# Altium schematic sheet Alimentacao.SchDoc
size A4; SheetNumber: 3; SheetTotal: 7; SPICEModelCacheZJBQYOKP: <root> / <DocumentId>ZJBQYOKP</DocumentId> / <CacheFrame Number="0"> / <Model Name="spst_switch" Kind="CKT"> / <Text>*------------------------- / *SPST Sw Button / * state: if closed&gt;0 - closed else open / * Rclosed -  Closed state resistance / * Ropen -  Open state resistance (Ropen/Rclosed &lt; 1E10) / .SUBCKT  SPST_Switch node1  node2  PARAMS: / + closed=0 / + Rclosed=1m / + Ropen=1Meg / B1 int1 0 V={if(closed&gt;0,1,0)} / S1 node1 node2 int1 0 Smod / .model Smod Vswitch(Ron={Rclosed} Roff={Ropen}) / .ends</Text> / </Model> / </CacheFrame> / </root>
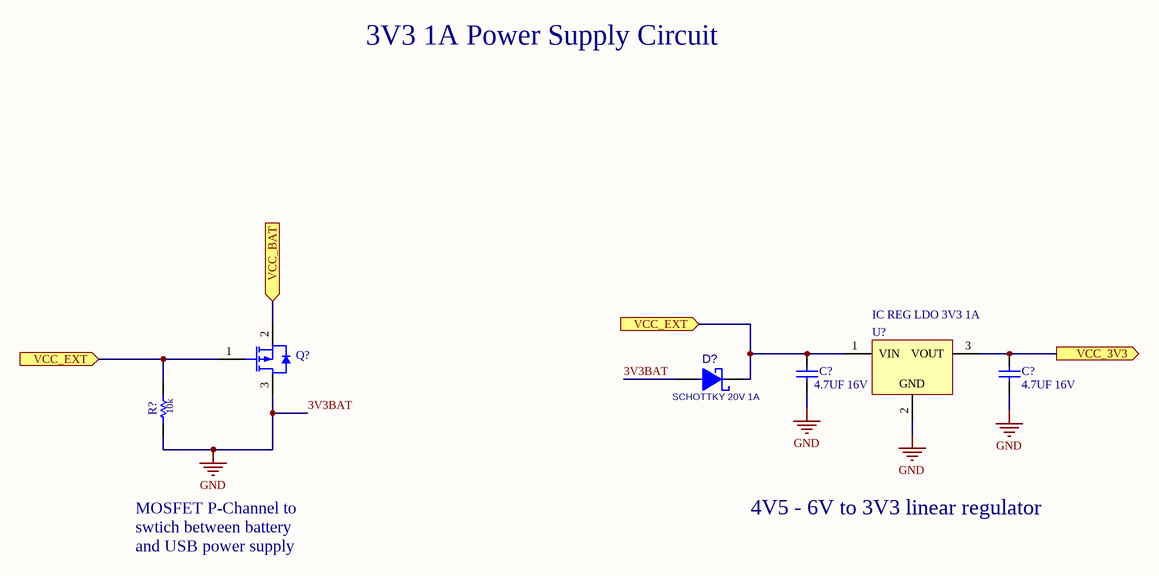
[diagram p0: Alimentacao.SchDoc]

## Parts
(Parts that share a designator on the sheet are numbered #1, #2 ... from top to bottom, then left to right.)
C?#1  4.7UF 16V  [CC2012-0805]
C?#2  4.7UF 16V  [CC2012-0805]
D?  SCHOTTKY 20V 1A  [SOD-323]
Q?  IC MOSFET P_CHANNEL 500mA  [SOT-23]  (value not drawn)
R?  RES 10K 1/10W 1% 0603 SMD  [CR1608-0603]  (value not drawn)
U?  IC REG LDO 3V3 1A  [SOT-223]

## Ports
VCC_3V3 (out), VCC_BAT (in), VCC_EXT (in)

## Nets
3V3BAT: C?#1.1 C?#2.1 D?.A Q?.3(DRAIN) R?.1 U?.2(GND)  [also labelled GND]
VCC_3V3: C?#2.2 U?.3(VOUT) ; port VCC_3V3
VCC_BAT: Q?.2(SOURCE) ; port VCC_BAT
VCC_EXT: C?#1.2 D?.K Q?.1(GATE) R?.2 U?.1(VIN) ; port VCC_EXT

## Notes on the sheet
- 3V3 1A Power Supply Circuit
- 4V5 - 6V to 3V3 linear regulator
- MOSFET P-Channel to swtich between battery and USB power supply

## Library data of the parts
C?#1 C?#2 = CMP-004-000075-2: CAP CER 4.7UF 16V X7R 0805; Manufacturer Part Number 1: 0805F475M160NT; Manufacturer 1: FH(Guangdong Fenghua Advanced Tech); Tolerance: 10%; Radiation Hardening: No; Thickness: 0.057inch; Package Quantity: 1; REACH SVHC: No SVHC; Case Code (Imperial): 0805; Termination: SMD/SMT; Case/Package: 0805; Supplier Unit Price 1: 0,0214; Case Code (Metric): 2012; Dielectric: X7R; Ratings: AEC-Q200; Voltage Rating: 16V; Depth: 1.25mm; Length: 2mm; Source: mits.SchLib; Design Item ID: CAP CER 4.7uF 16V 20% Y5V 0805 SMD; Resistor Type: Ceramic; RoHS Compliant: Yes; Packaging: Tape and Reel; Weight: 0.000194oz; Min Operating Temperature: -55°C; Height: 1.25mm; Capacitance: 4.7uF; Voltage Rating (DC): 16V; Width: 0.049inch; Max Operating Temperature: 125°C; Series: CGA; Mount: Surface Mount; Lead Free: Lead Free
D? = CMP-008-000014-1: DIODE SCHOTTKY 20V 1A SOD323; Manufacturer: ON Semiconductor; Manufacturer Part Number: NSR0320MW2T1G; Capacitance @ Vr, F: 29pF @ 5V, 1MHz; Speed: Fast Recovery =< 500ns, > 200mA (Io); Current - Reverse Leakage @ Vr: 50µA @ 15V; Current - Average Rectified (Io): 1A (DC); Voltage - Forward (Vf) (Max) @ If: 500mV @ 900mA; Pricing 1: 1=0.4, 10=0.298, 100=0.1689, 500=0.11188, 1000=0.08577 (USD); Design Item ID: DIODE SCHOTTKY NSR0320MW2T1G 20V 1A SOD323 SMD; Supplier Device Package: SOD-323; ComponentLink1URL: http://www.onsemi.com/pub_link/Collateral/NSR0320MW2T1-D.PDF; Packaging: Cut Tape (CT); Package / Case: SC-76, SOD-323; ComponentLink1Description: http://www.onsemi.com/pub_link/Collateral/NSR0320MW2T1-D.PDF; Reverse Recovery Time (trr): -; Voltage - DC Reverse (Vr) (Max): 20V; RoHS: RoHS Compliant; Mounting Type: Surface Mount; Diode Type: Schottky; Category: Discrete Semiconductor Products; Operating Temperature - Junction: -55°C ~ 125°C; Part Status: Active; Stock 1: 617; Source: mits.SchLib
Q? = IC MOSFET P_CHANNEL 500mA: P-Channel 30 V 530 mA 1 Ohm Surface Mount Enhancement Mode Mosfet - SOT-23; Manufacturer: Diodes; Manufacturer Part Number: DMP31D0U-7; Rise Time: 5.85ns; Drain to Source Voltage (Vdss): 30V; Continuous Drain Current (ID): 530mA; Rds On Max: 1R; Input Capacitance: 76pF; Max Power Dissipation: 450mW; Turn-On Delay Time: 4.98ns; Turn-Off Delay Time: 35.71ns; Fall Time: 16.64ns; Drain to Source Resistance: 2R; Element Configuration: Single; Gate to Source Voltage (Vgs): 8V; RoHS: Yes; Category: MOSFETs; Stock 1: 11550; Pricing 1: 50=0,43400, 500=0,36900, 1250=0,32500, 5000=0,28200 (USD); Mount: Surface Mount; Case/Package: SOT-23; Number of Pins: 3; Min Operating Temperature: -55°C; Max Operating Temperature: 150°C; Packaging: Tape and Reel; Length: 3mm; Width: 1.4mm; Height: 1.1mm; Radiation Hardening: No; RoHS Compliant: Yes; ComponentLink1URL: https://datasheet.ciiva.com/30023/dmp31d0u-30023794.pdf?src-supplier=Avnet; ComponentLink1Description: https://datasheet.ciiva.com/30023/dmp31d0u-30023794.pdf?src-supplier=Avnet; Supplier 1: RSComponents
R? = CMP-018-000009-1: RES 10K OHM 1/10W 1% 0603 SMD; Manufacturer Part Number: RC0603FR-0710KL; Manufacturer: Yageo; Temperature Coefficient: ±100ppm/°C; Power (Watts): 0.1W, 1/10W; RoHS: RoHS Compliant; Resistance: 10k; Pricing 1: 1=0.1, 10=0.013, 25=0.0092, 50=0.007, 100=0.0052, 250=0.00396, 500=0.00316, 1000=0.00233 (USD); Category: Resistors; Package / Case: 0603 (1608 Metric); Part Status: Active; Size / Dimension: 0.063" L x 0.031" W (1.60mm x 0.80mm); Supplier Device Package: 0603; Features: Moisture Resistant; Design Item ID: RES 10K 1/10W 1% 0603 SMD; Stock 1: 17789030; Source: mits.SchLib; Failure Rate: -; ComponentLink1Description: http://www.yageo.com/documents/recent/PYu-RC_Group_51_RoHS_L_7.pdf; Height - Seated (Max): 0.022" (0.55mm); ComponentLink1URL: http://www.yageo.com/documents/recent/PYu-RC_Group_51_RoHS_L_7.pdf; Operating Temperature: -55°C ~ 155°C; Tolerance: ±1%; Packaging: Cut Tape (CT); Composition: Thick Film
U? = IC REG LDO 3V3 1A: IC REG LDO 3.3V 1A SOT223; Manufacturer: Diodes; Manufacturer Part Number: AP2114HA-3.3TRG1; Dropout Voltage: 450mV; Number of Regulators: 1; Polarity: Positive; Quiescent Current: 90uA; Accuracy: 1.5%; Min Input Voltage: 2.5V; Max Input Voltage: 6V; Output Type: Fixed; Supplier 1: Digi-Key; RoHS: Yes; Category: Voltage Regulators - Linear; Stock 1: 1890; Pricing 1: 1=0,39000, 10=0,31700, 25=0,29000, 100=0,21570, 250=0,19552, 500=0,16180, 1000=0,12135 (USD); Mount: Surface Mount; Case/Package: TO-261-4; Number of Pins: 3; Contact Plating: Tin; Min Operating Temperature: -40°C; Max Operating Temperature: 85°C; Packaging: Tape and Reel; Package Quantity: 4000; Output Voltage: 3.3V; Output Current: 1A; Max Output Current: 1A; Number of Outputs: 1; RoHS Compliant: Yes; ComponentLink1URL: https://datasheet.ciiva.com/29568/ap2114-29568886.pdf?src-supplier=Digi-Key; ComponentLink1Description: https://datasheet.ciiva.com/29568/ap2114-29568886.pdf?src-supplier=Digi-Key; Supplier Part Number 1: AP2114HA-3.3TRG1DICT-ND